# EAGLE schematic d232_board (EAGLE 9.5.0)
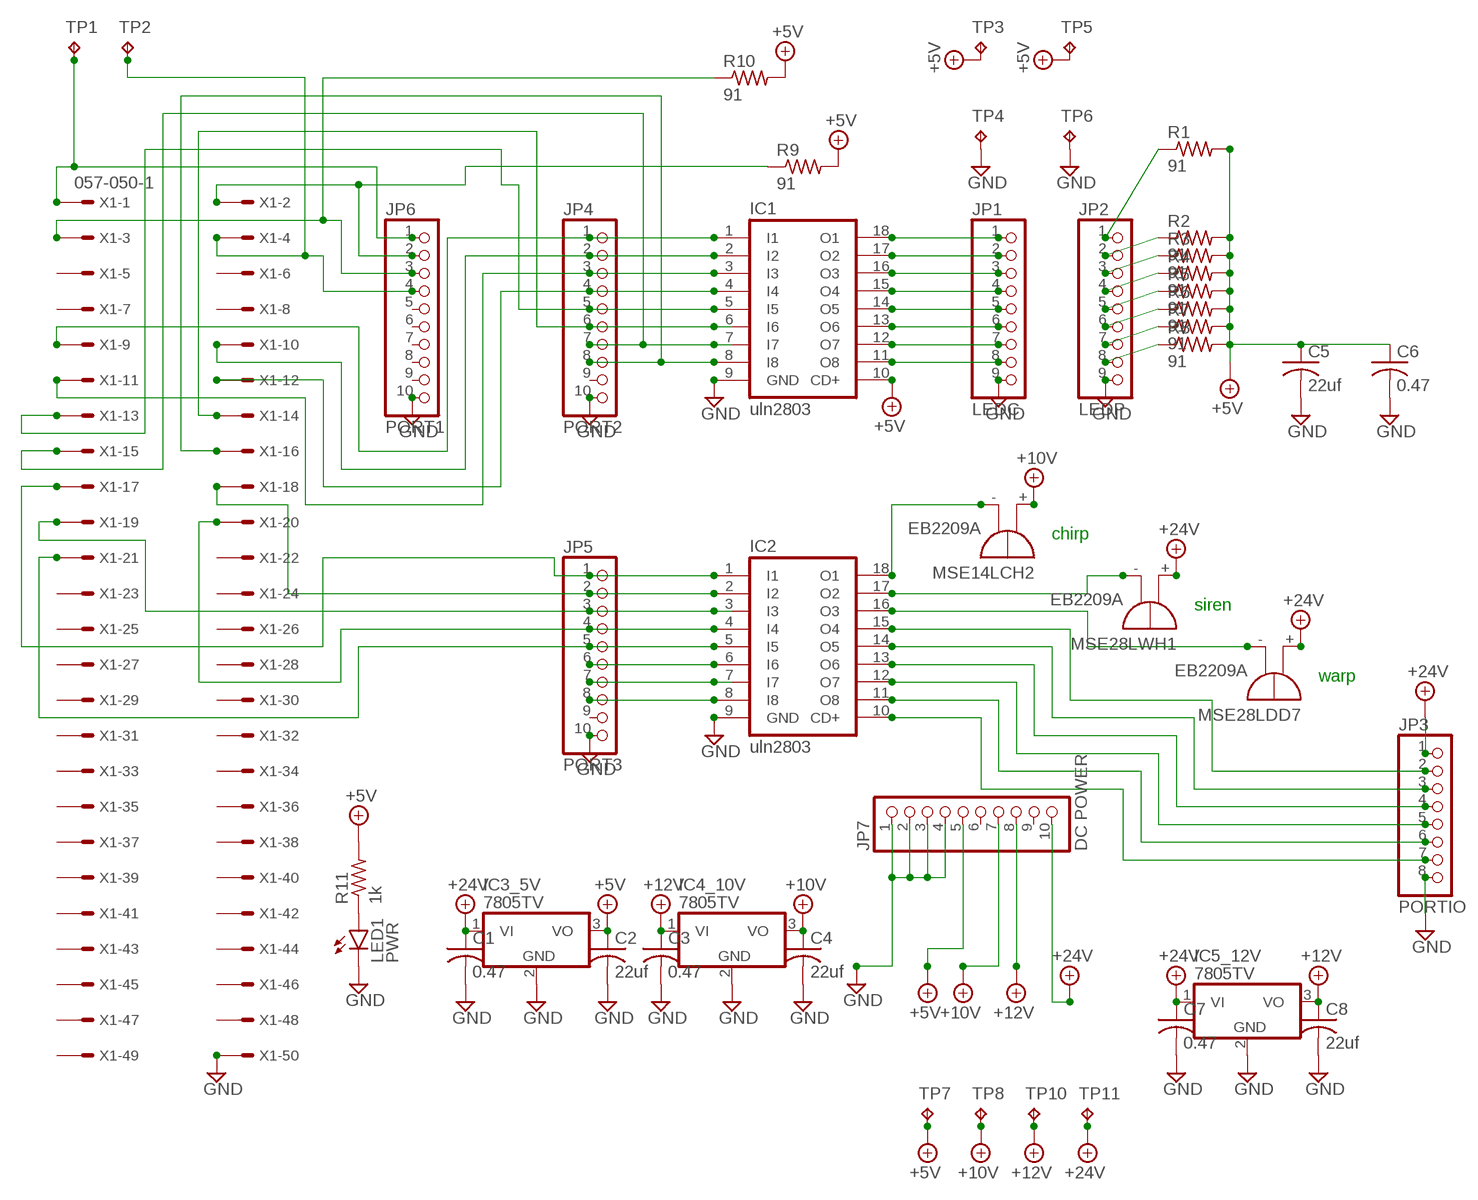
[diagram p0: schematic, sheet 1]

## Parts
C1  0.47  C-USC1206K  [C1206K]
C2  22uf  C-USC1206K  [C1206K]
C3  0.47  C-USC1206K  [C1206K]
C4  22uf  C-USC1206K  [C1206K]
C5  22uf  C-USC1206K  [C1206K]
C6  0.47  C-USC1206K  [C1206K]
C7  0.47  C-USC1206K  [C1206K]
C8  22uf  C-USC1206K  [C1206K]
IC1  uln2803  ULN2803A  [DIL18]
IC2  uln2803  ULN2803A  [DIL18]
IC3_5V  7805TV  [TO220V]
IC4_10V  7805TV  [TO220V]
IC5_12V  7805TV  [TO220V]
JP1  LEDC  PINHD-1X9  [1X09]
JP2  LEDP  PINHD-1X9  [1X09]
JP3  PORTIO  PINHD-1X8  [1X08]
JP4  PORT2  PINHD-1X10  [1X10]
JP5  PORT3  PINHD-1X10  [1X10]
JP6  PORT1  PINHD-1X10  [1X10]
JP7  DC POWER  PINHD-1X10  [1X10]
LED1  PWR  LEDCHIPLED_1206  [CHIPLED_1206]
MSE14LCH2  EB2209A  [EB2209A]
MSE28LDD7  EB2209A  [EB2209A]
MSE28LWH1  EB2209A  [EB2209A]
R1  91  R-US_0204/2V  [0204V]
R2  91  R-US_0204/2V  [0204V]
R3  91  R-US_0204/2V  [0204V]
R4  91  R-US_0204/2V  [0204V]
R5  91  R-US_0204/2V  [0204V]
R6  91  R-US_0204/2V  [0204V]
R7  91  R-US_0204/2V  [0204V]
R8  91  R-US_0204/2V  [0204V]
R9  91  R-US_0204/2V  [0204V]
R10  91  R-US_0204/2V  [0204V]
R11  1k  R-US_0204/2V  [0204V]
TP1  TPB2,54  [B2,54]
TP2  TPB2,54  [B2,54]
TP3  TPB2,54  [B2,54]
TP4  TPB2,54  [B2,54]
TP5  TPB2,54  [B2,54]
TP6  TPB2,54  [B2,54]
TP7  TPB2,54  [B2,54]
TP8  TPB2,54  [B2,54]
TP10  TPB2,54  [B2,54]
TP11  TPB2,54  [B2,54]
X1  057-050-1  [057-050-1]

## Nets
+5V: C2.1 C5.1 C6.1 IC1.10(CD+) IC3_5V.3(VO) JP7.5 R1.2 R2.2 R3.2 R4.2 R5.2 R6.2 R7.2 R8.2 R9.2 R10.2 R11.2 TP3.TP TP5.TP TP7.TP
+10V: C4.1 IC4_10V.3(VO) JP7.7 MSE14LCH2.+ TP8.TP
+12V: C3.1 C8.1 IC4_10V.1(VI) IC5_12V.3(VO) JP7.8 TP10.TP
+24V: C1.1 C7.1 IC3_5V.1(VI) IC5_12V.1(VI) JP3.1 JP7.10 MSE28LDD7.+ MSE28LWH1.+ TP11.TP
GND: C1.2 C2.2 C3.2 C4.2 C5.2 C6.2 C7.2 C8.2 IC1.9(GND) IC2.9(GND) IC3_5V.2(GND) IC4_10V.2(GND) IC5_12V.2(GND) JP1.9 JP2.9 JP3.8 JP4.10 JP5.10 JP6.10 JP7.1 JP7.2 JP7.3 JP7.4 LED1.C TP4.TP TP6.TP X1.50
N$1: IC1.18(O1) JP1.1
N$2: IC1.17(O2) JP1.2
N$3: IC1.16(O3) JP1.3
N$4: IC1.15(O4) JP1.4
N$5: IC1.14(O5) JP1.5
N$6: IC1.13(O6) JP1.6
N$7: IC1.12(O7) JP1.7
N$8: IC1.11(O8) JP1.8
N$9: IC1.1(I1) JP4.1 X1.9
N$10: IC1.2(I2) JP4.2 X1.10
N$11: IC1.3(I3) JP4.3 X1.11
N$12: IC1.4(I4) JP4.4 X1.12
N$13: IC1.5(I5) JP4.5 X1.13
N$14: IC1.6(I6) JP4.6 X1.14
N$15: IC1.7(I7) JP4.7 X1.15
N$16: IC1.8(I8) JP4.8 X1.16
N$17: IC2.1(I1) JP5.1 X1.17
N$18: IC2.2(I2) JP5.2 X1.18
N$19: IC2.3(I3) JP5.3 X1.19
N$20: IC2.4(I4) JP5.4 X1.20
N$21: IC2.5(I5) JP5.5 X1.21
N$22: IC2.6(I6) JP5.6
N$23: IC2.7(I7) JP5.7
N$24: IC2.8(I8) JP5.8
N$25: IC2.18(O1) MSE14LCH2.-
N$26: IC2.17(O2) MSE28LWH1.-
N$27: IC2.16(O3) MSE28LDD7.-
N$28: JP6.1 TP1.TP X1.1
N$29: JP6.2 R9.1 X1.2
N$30: JP6.3 R10.1 X1.3
N$31: JP6.4 TP2.TP X1.4
N$32: JP2.1 R1.1
N$33: JP2.2 R2.1
N$34: JP2.3 R3.1
N$35: JP2.4 R4.1
N$36: JP2.5 R5.1
N$37: JP2.6 R6.1
N$38: JP2.7 R7.1
N$39: JP2.8 R8.1
N$40: IC2.15(O4) JP3.2
N$41: IC2.14(O5) JP3.3
N$42: IC2.13(O6) JP3.4
N$43: IC2.12(O7) JP3.5
N$44: IC2.11(O8) JP3.6
N$45: IC2.10(CD+) JP3.7
N$46: LED1.A R11.1
Unconnected: JP4.9 JP5.9 JP6.5 JP6.6 JP6.7 JP6.8 JP6.9 JP7.6 JP7.9 X1.5 X1.6 X1.7 X1.8 X1.22 X1.23 X1.24 X1.25 X1.26 X1.27 X1.28 X1.29 X1.30 X1.31 X1.32 X1.33 X1.34 X1.35 X1.36 X1.37 X1.38 X1.39 X1.40 X1.41 X1.42 X1.43 X1.44 X1.45 X1.46 X1.47 X1.48 X1.49

## Notes on the sheet
- chirp
- siren
- warp

## Library data of the parts
C1-C8 = rcl:C-US: CAPACITOR, American symbol; SPICEPREFIX: C
IC1 IC2 = uln-udn:ULN2803A: DRIVER ARRAY
IC3_5V IC4_10V IC5_12V = linear:78*: Positive VOLTAGE REGULATOR Source: http://cache.national.com/ds/LM/LM78L05.pdf http://www.fairchildsemi.com/ds/LM/LM7805.pdf
JP1 JP2 = pinhead:PINHD-1X9: PIN HEADER
JP3 = pinhead:PINHD-1X8: PIN HEADER
JP4-JP7 = pinhead:PINHD-1X10: PIN HEADER
LED1 = led:LED: LED OSRAM: - CHIPLED LG R971, LG N971, LY N971, LG Q971, LY Q971, LO R971, LY R971 LH N974, LH R974 LS Q976, LO Q976, LY Q976 LO Q996 - Hyper CHIPLED LW Q18S LB Q993, LB Q99A, LB R99A - SideLED LS A670, LO A670, LY A670, LG A670, LP A670 LB A673, LV A673, LT A673, LW A673 LH A674 LY A675 LS A676, LA A676, LO A676, LY A676, LW A676 LS A679, LY A679, LG A679 - Hyper Micro SIDELED® LS Y876, LA Y876, LO Y876, LY Y876 LT Y87S - SmartLED LW L88C, LW L88S LB L89C, LB L89S, LG L890 LS L89K, LO L89K, LY L89K LS L896, LA L896, LO L896, LY L896 - TOPLED LS T670, LO T670, LY T670, LG T670, LP T670 LSG T670, LSP T670, LSY T670, LOP T670, LYG T670 LG T671, LOG T671, LSG T671 LB T673, LV T673, LT T673, LW T673 LH T674 LS T676, LA T676, LO T676, LY T676, LB T676, LH T676, LSB T676, LW T676 LB T67C, LV T67C, LT T67C, LS T67K, LO T67K, LY T67K, LW E67C LS E67B, LA E67B, LO E67B, LY E67B, LB E67C, LV E67C, LT E67C LW T67C LS T679, LY T679, LG T679 LS T770, LO T770, LY T770, LG T770, LP T770 LB T773, LV T773, LT T773, LW T773 LH T774 LS E675, LA E675, LY E675, LS T675 LS T776, LA T776, LO T776, LY T776, LB T776 LHGB T686 LT T68C, LB T68C - Hyper Mini TOPLED® LB M676 - Mini TOPLED Santana® LG M470 LS M47K, LO M47K, LY M47K Source: http://www.osram.convergy.de LUXEON: - LUMILED® LXK2-PW12-R00, LXK2-PW12-S00, LXK2-PW14-U00, LXK2-PW14-V00 LXK2-PM12-R00, LXK2-PM12-S00, LXK2-PM14-U00 LXK2-PE12-Q00, LXK2-PE12-R00, LXK2-PE12-S00, LXK2-PE14-T00, LXK2-PE14-U00 LXK2-PB12-K00, LXK2-PB12-L00, LXK2-PB12-M00, LXK2-PB14-N00, LXK2-PB14-P00, LXK2-PB14-Q00 LXK2-PR12-L00, LXK2-PR12-M00, LXK2-PR14-Q00, LXK2-PR14-R00 LXK2-PD12-Q00, LXK2-PD12-R00, LXK2-PD12-S00 LXK2-PH12-R00, LXK2-PH12-S00 LXK2-PL12-P00, LXK2-PL12-Q00, LXK2-PL12-R00 Source: www.luxeon.com KINGBRIGHT: KA-3528ASYC Source: www.kingbright.com
MSE14LCH2 MSE28LDD7 MSE28LWH1 = buzzer:EB2209A: BUZZER Source: Buerklin; OC_FARNELL: unknown; OC_NEWARK: unknown
R1-R11 = rcl:R-US_: RESISTOR, American symbol; SPICEPREFIX: R
TP1-TP8 TP10 TP11 = testpad:TP: Test pad
X1 = con-panduit:057-050-: CONNECTOR 50-pin series 057 contact pc board low profile headers; OC_FARNELL: unknown; OC_NEWARK: unknown